# Altium schematic sheet Sensor Board.SchDoc
size A
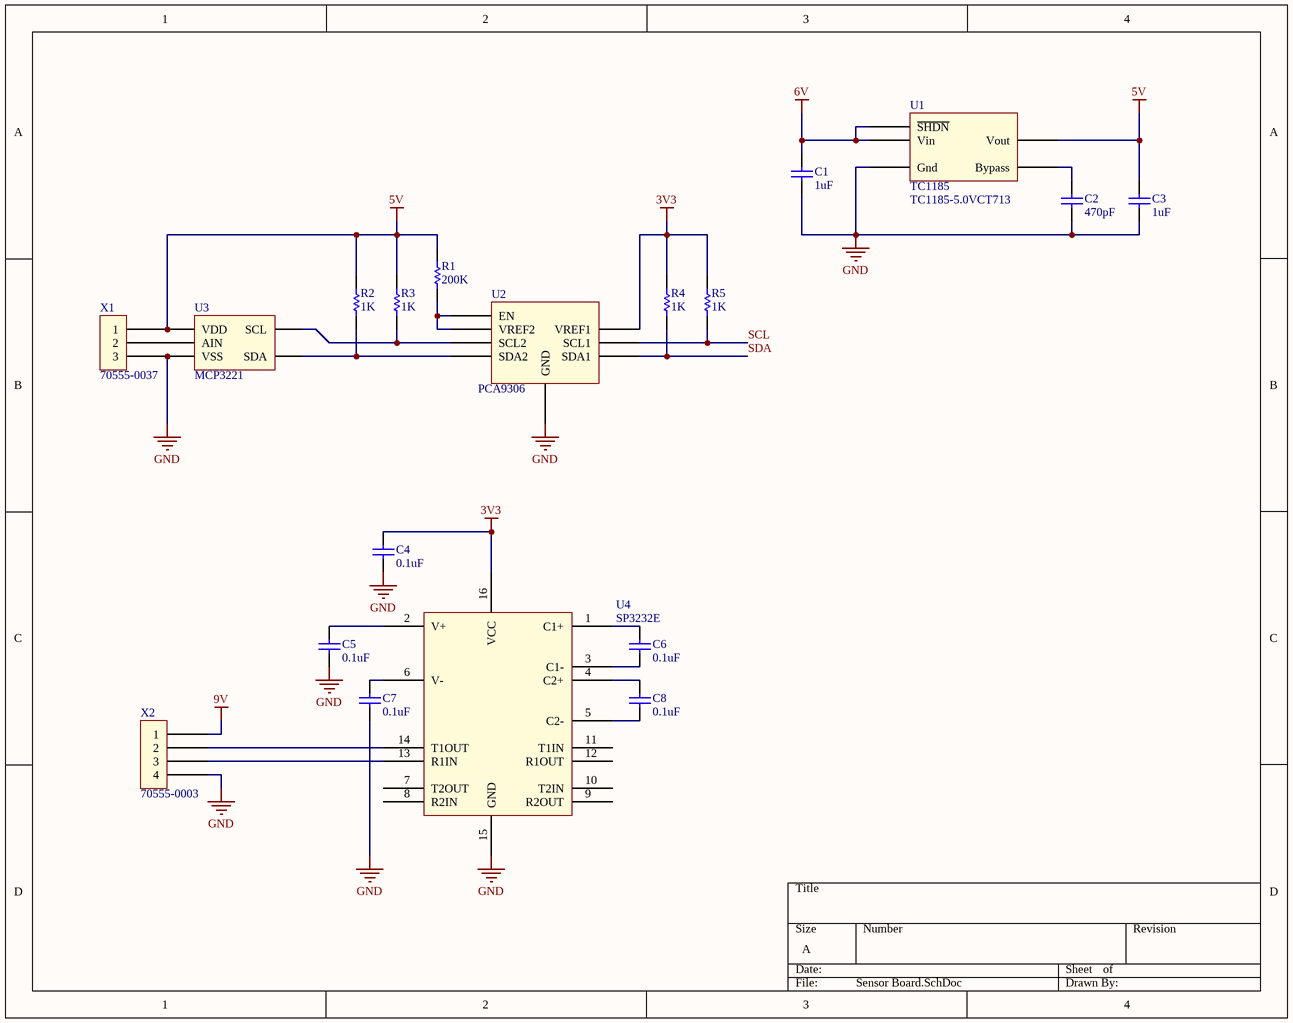
[diagram p0: Sensor Board.SchDoc]

## Parts
C1  value 1uF  [C0603]  (hidden comment: Cap)
C2  value 470pF  [C0603]  (hidden comment: Cap)
C3  value 1uF  [C0603]  (hidden comment: Cap)
C4  value 0.1uF  [C0805]  (hidden comment: Cap)
C5  value 0.1uF  [C0805]  (hidden comment: Cap)
C6  value 0.1uF  [C0805]  (hidden comment: Cap)
C7  value 0.1uF  [C0805]  (hidden comment: Cap)
C8  value 0.1uF  [C0805]  (hidden comment: Cap)
R1  value 200K  [R0603]  (hidden comment: Resistor)
R2  value 1K  [R0603]  (hidden comment: Resistor)
R3  value 1K  [R0603]  (hidden comment: Resistor)
R4  value 1K  [R0603]  (hidden comment: Resistor)
R5  value 1K  [R0603]  (hidden comment: Resistor)
U1  TC1185  Part Number: TC1185-5.0VCT713  [TC1185-SOT23-5]
U2  PCA9306  [PCA9306-SO8]
U3  MCP3221  [MCP3221-SOT23-5]
U4  SP3232E  [SP3232E-SSOP16]
X1  70555-0037  [70555-0037]
X2  70555-0003  [70555-0003]

## Nets
3V3: C4.1 R4.2 R5.2 U2.VREF1 U4.16(VCC)
5V: C3.1 R1.2 R2.2 R3.2 U1.VOUT(Vout) U3.VDD X1.1
6V: C1.1 U1.SHDN(~{SHDN}) U1.VIN(Vin)
9V: X2.1
GND: C1.2 C2.2 C3.2 C4.2 C5.2 C7.2 U1.GND(Gnd) U2.GND U3.VSS U4.15(GND) X1.3 X2.4
SCL: R5.1 U2.SCL1
SDA: R4.1 U2.SDA1
NetC2_1: C2.1 U1.BYPASS(Bypass)
NetC5_1: C5.1 U4.2(V+)
NetC6_1: C6.1 U4.1(C1+)
NetC6_2: C6.2 U4.3(C1-)
NetC7_1: C7.1 U4.6(V-)
NetC8_1: C8.1 U4.4(C2+)
NetC8_2: C8.2 U4.5(C2-)
NetR1_1: R1.1 U2.EN U2.VREF2
NetR2_1: R2.1 U2.SDA2 U3.SDA
NetR3_1: R3.1 U2.SCL2 U3.SCL
NetU3_AIN: U3.AIN X1.2
NetU4_13: U4.13(R1IN) X2.3
NetU4_14: U4.14(T1OUT) X2.2

Not connected (* = marked no-connect by the designer): U4 7(T2OUT) 8(R2IN) 9(R2OUT) 10(T2IN) 11(T1IN) 12(R1OUT)

## Library data of the parts
C1-C8 = Cap: Unpolarized Capacitor
  C4-C8: Supplier Part Number 1: *; Supplier 1: *
R1-R5 = Res: Tolerance: 5%
U1 = TC1185: TC1185 LDO Regulator; Supplier 1: Digi-Key; Supplier Part Number 1: TC11855.0VCT713CT-ND
U2 = PCA9306: PCA9306, Bidirectional level translator; Supplier Part Number 1: 568-4215-1-ND; Supplier 1: Digi-Key
U3 = MCP3221: MCP3221, 12 bit ADC, I2C; Supplier 1: Digi-Key; Supplier Part Number 1: MCP3221A5T-I/OTCT-ND
U4 = SP3232E: RS232 Transceiver; URL: http://search.digikey.com/us/en/products/SP3232ECA-L/1016-1101-5-ND/2411033
X1 = 70555-0037: Molex, C-Grid SL 70555, 3 Pin; URL: http://search.digikey.com/us/en/products/70555-0037/WM4176-ND/1643410; Supplier 1: Digi-Key; Supplier Part Number 1: WM4176-ND
X2 = 70555-0003: Molex, C-Grid SL 70555, 4 Pin; URL: http://search.digikey.com/us/en/products/70555-0003/WM4166-ND/1643400